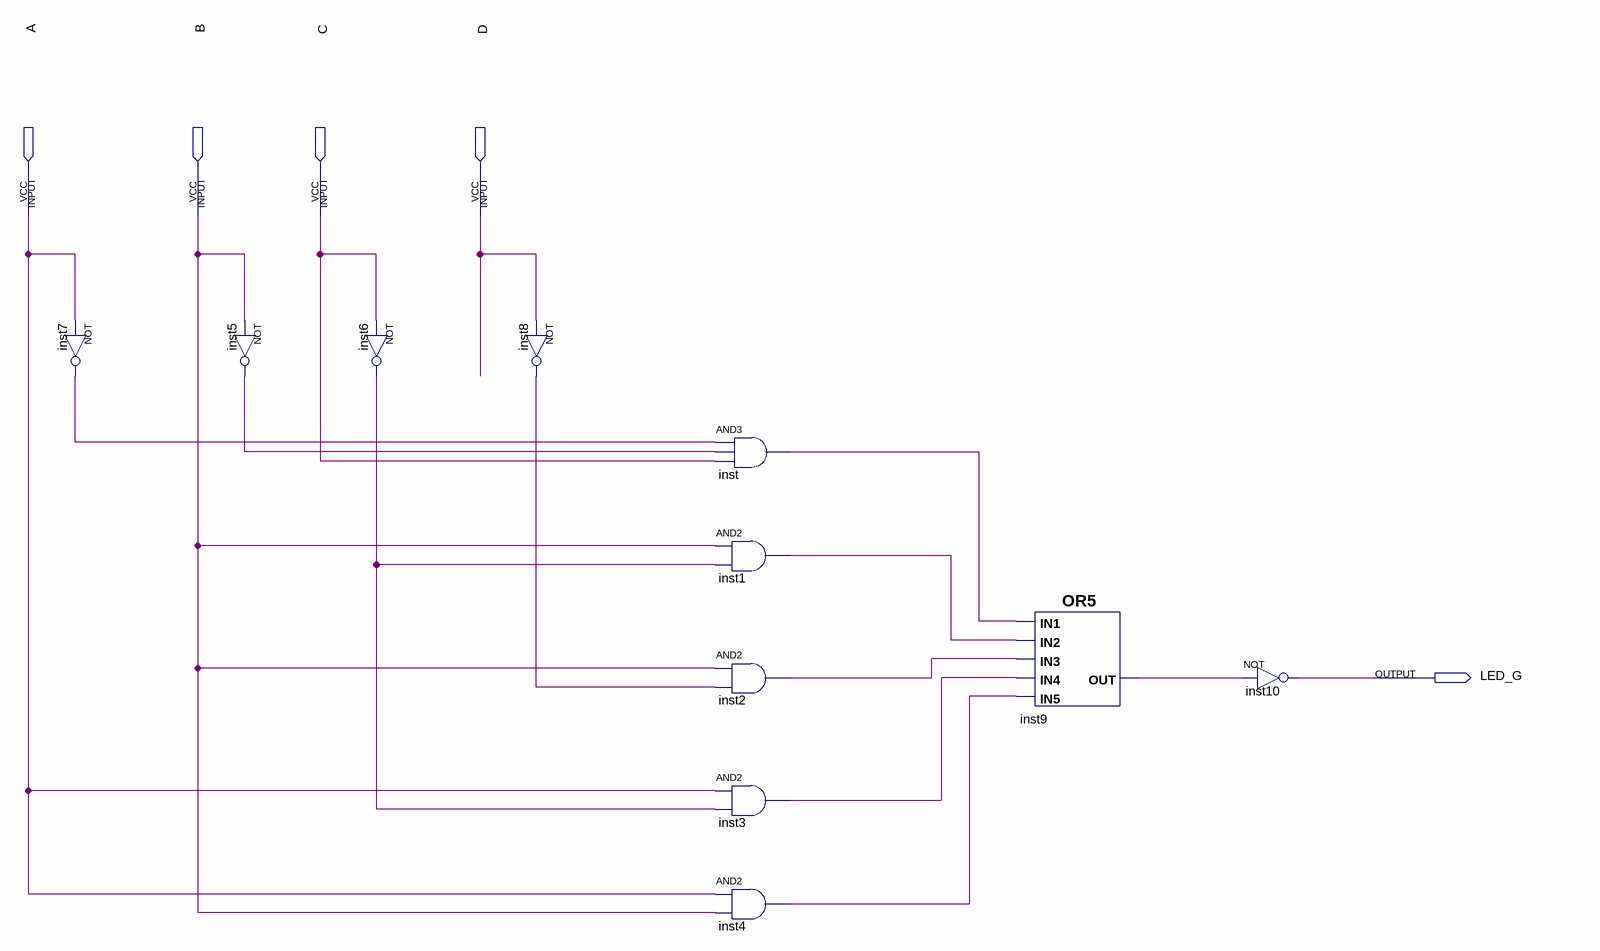
[diagram p0: schematic sheet]
// Quartus schematic led_g.bdf as structural Verilog: 11 symbols, 5 pins
module led_g (
  input  A,
  input  B,
  input  C,
  input  D,
  output LED_G
);

  wire inst1_out, inst2_out, inst3_out, inst4_out, inst5_out, inst6_out, inst7_out, inst8_out, inst9_out,
       inst_out;

  not inst7 (inst7_out, A);
  not inst5 (inst5_out, B);
  not inst6 (inst6_out, C);
  not inst8 (inst8_out, D);
  and inst (inst_out, inst7_out, inst5_out, C);
  and inst1 (inst1_out, B, inst6_out);
  and inst2 (inst2_out, B, inst8_out);
  and inst3 (inst3_out, A, inst6_out);
  and inst4 (inst4_out, A, B);
  or inst9 (inst9_out, inst_out, inst1_out, inst2_out, inst3_out, inst4_out);
  not inst10 (LED_G, inst9_out);
endmodule
